# Altium schematic sheet Sheet1.SchDoc: Power Supply Active Load Testing Unit
size A4; SheetNumber: 1; SheetTotal: 1; PageSetup: Record=PageOptions|CenterHorizontal=True|CenterVertical=True|PrintScale=1.00|XCorrection=1.00|YCorrection=1.00|PrintKind=0|BorderSize=5000000|LeftOffset=0|BottomOffset=0|Orientation=2|PaperLength=1000|PaperWidth=1000|Scale=100|PaperSource=7|PrintQuality=-3|MediaType=1|DitherType=10|PrintScaleMode=1|PaperKind=A4|PaperIndex=9
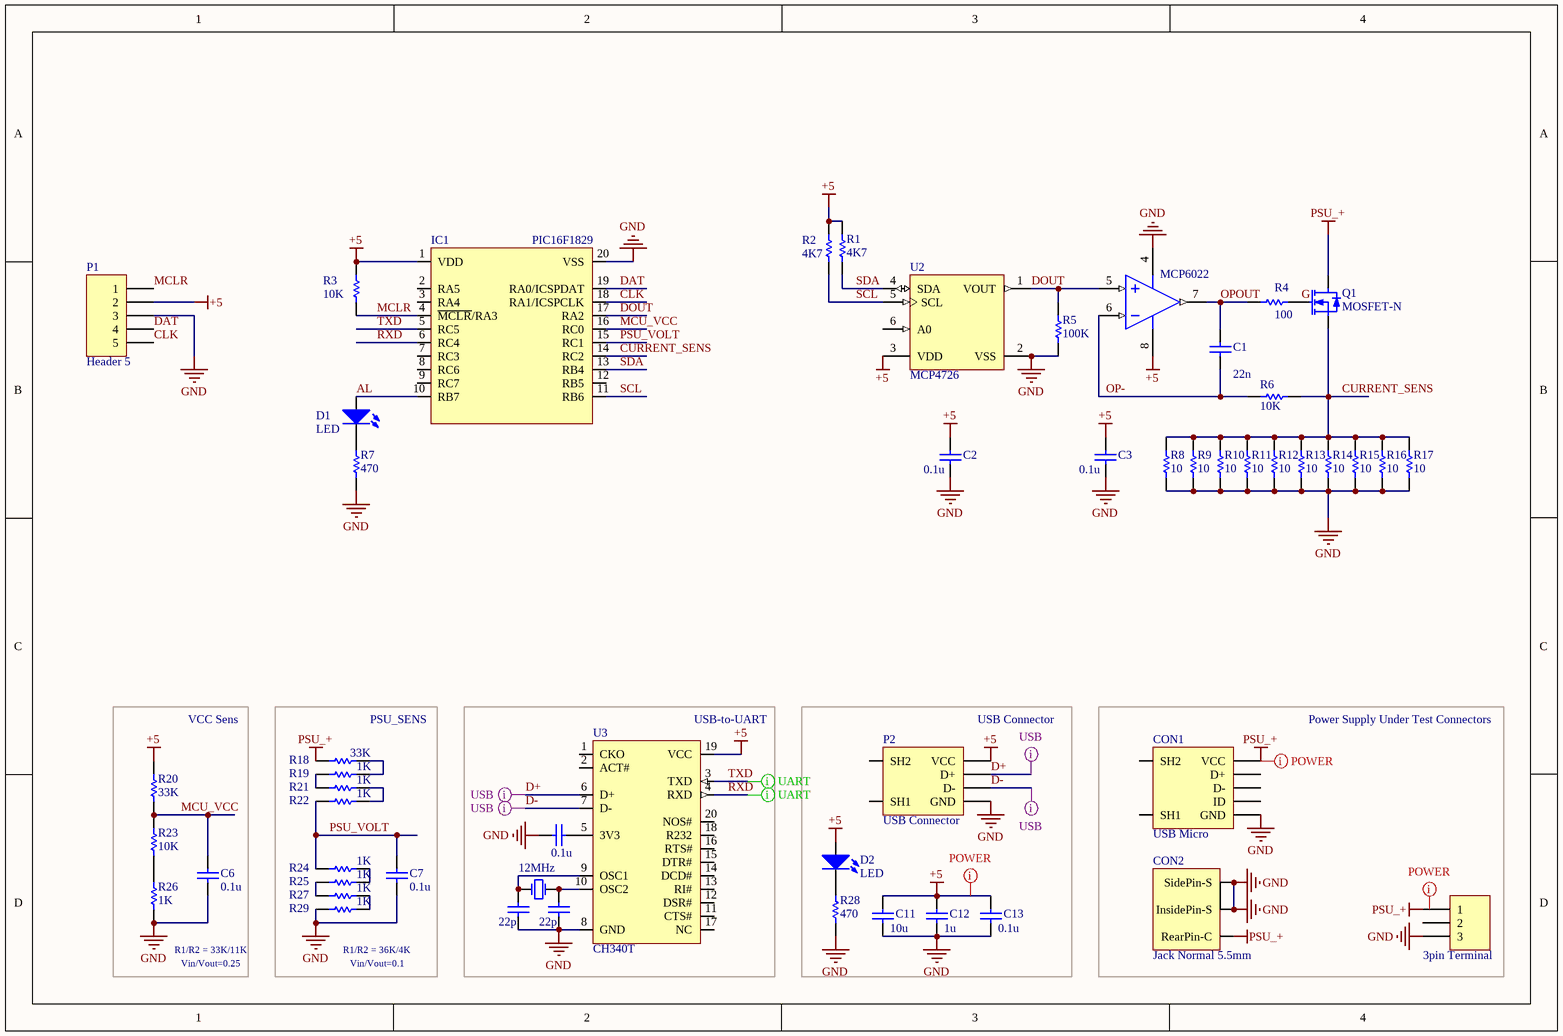
[diagram p0: Sheet1.SchDoc]

## Parts
C1  value 22n  [0805]  (hidden comment: Cap)
C2  value 0.1u  [0805]  (hidden comment: Cap)
C3  value 0.1u  [0805]  (hidden comment: Cap)
C5  value 0.1u  [0805]  (hidden comment: Cap)
C6  value 0.1u  [0805]  (hidden comment: Cap)
C7  value 0.1u  [0805]  (hidden comment: Cap)
C8  value 22p  [0805]  (hidden comment: Cap)
C9  value 22p  [0805]  (hidden comment: Cap)
C11  value 10u  [0805]  (hidden comment: Cap)
C12  value 1u  [0805]  (hidden comment: Cap)
C13  value 0.1u  [0805]  (hidden comment: Cap)
CON1  USB Micro  [USB Micro SMD]
CON2  Jack Normal 5.5mm  [Jack Normal]
CON3  3pin Terminal  [Terminal 3]
D1  LED  [LED 5mm [2.54 pin]]
D2  LED  [0805 -  LED]
IC1  PIC16F1829  [SOP20]
P1  Header 5  [Header 5x1]
P2  USB Connector  [USB Mini SMD TOP]
Q1  MOSFET-N  [TO-220 w HS2]
R1  value 4K7  [Axial 0.4]  (hidden comment: Res)
R2  value 4K7  [Axial 0.4]  (hidden comment: Res)
R3  value 10K  [0805]  (hidden comment: Res)
R4  value 100  [0805]  (hidden comment: Res)
R5  value 100K  [Axial 0.4]  (hidden comment: Res)
R6  value 10K  [0805]  (hidden comment: Res)
R7  value 470  [Axial 0.4]  (hidden comment: Res)
R8  value 10  [Axial 0.4]  (hidden comment: Res)
R9  value 10  [Axial 0.4]  (hidden comment: Res)
R10  value 10  [Axial 0.4]  (hidden comment: Res)
R11  value 10  [Axial 0.4]  (hidden comment: Res)
R12  value 10  [Axial 0.4]  (hidden comment: Res)
R13  value 10  [Axial 0.4]  (hidden comment: Res)
R14  value 10  [Axial 0.4]  (hidden comment: Res)
R15  value 10  [Axial 0.4]  (hidden comment: Res)
R16  value 10  [Axial 0.4]  (hidden comment: Res)
R17  value 10  [Axial 0.4]  (hidden comment: Res)
R18  value 33K  [0805]  (hidden comment: Res)
R19  value 1K  [0805]  (hidden comment: Res)
R20  value 33K  [0805]  (hidden comment: Res)
R21  value 1K  [0805]  (hidden comment: Res)
R22  value 1K  [0805]  (hidden comment: Res)
R23  value 10K  [0805]  (hidden comment: Res)
R24  value 1K  [0805]  (hidden comment: Res)
R25  value 1K  [0805]  (hidden comment: Res)
R26  value 1K  [0805]  (hidden comment: Res)
R27  value 1K  [0805]  (hidden comment: Res)
R28  value 470  [0805]  (hidden comment: Res)
R29  value 1K  [0805]  (hidden comment: Res)
U1  MCP6022  [PDIP300-P8]  (part B of 2)
U2  MCP4726  [SOT-23-CH6_N]
U3  CH340T  [SOP20-5.30mm-0.65pitch]
Y1  12MHz  [HC-49S]

## Blocks framed on the sheet
VCC Sens: C6 R20 R23 R26
PSU_SENS: C7 R18 R19 R21 R22 R24 R25 R27 R29
USB-to-UART: C5 C8 C9 U3 Y1
USB Connector: C11-C13 D2 P2 R28
Power Supply Under Test Connectors: CON1-CON3

## Nets
+5: C2.2 C3.2 C11.2 C12.2 C13.2 D2.A IC1.1(VDD) P1.2 P2.VCC R1.2 R2.2 R3.2 R20.2 U1.8(VDD) U2.3(VDD) U3.19(VCC)
GND: C2.1 C3.1 C5.2 C6.1 C7.1 C8.1 C9.1 C11.1 C12.1 C13.1 CON1.GND CON2.InsidePin(InsidePin-S) CON2.SidePin(SidePin-S) CON3.3 IC1.20(VSS) P1.3 P2.GND R5.1 R7.1 R8.1 R9.1 R10.1 R11.1 R12.1 R13.1 R14.1 R15.1 R16.1 R17.1 R26.1 R28.1 R29.2 U1.4(VSS) U2.2(VSS) U3.8(GND)
PSU_+: CON1.VCC CON2.RearPin(RearPin-C) CON3.1 Q1.2(D) R18.2
AL: D1.A IC1.10(RB7)
CLK: IC1.18(RA1/ICSPCLK) P1.5
CURRENT_SENS: IC1.14(RC2) Q1.3(S) R6.2 R8.2 R9.2 R10.2 R11.2 R12.2 R13.2 R14.2 R15.2 R16.2 R17.2
D+: P2.D+ U3.6(D+)
D-: P2.D- U3.7(D-)
DAT: IC1.19(RA0/ICSPDAT) P1.4
DOUT: IC1.17(RA2) R5.2 U1.5(VINB+) U2.1(VOUT)
G: Q1.1(G) R4.2
MCLR: IC1.4(~{MCLR}/RA3) P1.1 R3.1
MCU_VCC: C6.2 IC1.16(RC0) R20.1 R23.2
OP-: C1.1 R6.1 U1.6(VINB-)
OPOUT: C1.2 R4.1 U1.7(VOUTB)
PSU_VOLT: C7.2 IC1.15(RC1) R22.2 R24.2
RXD: IC1.6(RC4) U3.4(RXD)
SCL: IC1.11(RB6) R2.1 U2.5(SCL)
SDA: IC1.13(RB4) R1.1 U2.4(SDA)
TXD: IC1.5(RC5) U3.3(TXD)
NetC5_1: C5.1 U3.5(3V3)
NetC8_2: C8.2 U3.9(OSC1) Y1.1(OSC1)
NetC9_2: C9.2 U3.10(OSC2) Y1.2(OSC2)
NetD1_K: D1.K R7.2
NetD2_K: D2.K R28.2
NetR18_1: R18.1 R19.1
NetR19_2: R19.2 R21.2
NetR21_1: R21.1 R22.1
NetR23_1: R23.1 R26.2
NetR24_1: R24.1 R25.1
NetR25_2: R25.2 R27.2
NetR27_1: R27.1 R29.1

Not connected (* = marked no-connect by the designer): CON1 D+ D- ID SH1 SH2; CON3 2; IC1 2(RA5) 3(RA4) 7(RC3) 8(RC6) 9(RC7) 12(RB5); P2 SH1 SH2; U2 6(A0); U3 1(CKO) 2(ACT#) 11(CTS#) 12(DSR#) 13(RI#) 14(DCD#) 15(DTR#) 16(RTS#) 17(NC) 18(R232) 20(NOS#)

## Layout directives
net class USB: D+, D-
net class UART: RXD, TXD
net class POWER: (no net found under the mark), +5, PSU_+

## Notes on the sheet
- R1/R2 = 33K/11K
- Vin/Vout=0.25
- R1/R2 = 36K/4K
- Vin/Vout=0.1

## Library data of the parts
C1-C3 C5-C9 C11-C13 = Cap: Capacitor; Published: 8-Jun-2000; LatestRevisionDate: 17-Jul-2002; LatestRevisionNote: Re-released for DXP Platform.; PackageReference: RAD-0.3; Publisher: Altium Limited; PackageDescription: Radial Cap, Thru-Hole; 2 Leads; 0.3 in Pin Spacing
CON1 = USB Micro TH: Header, 4-Pin; LatestRevisionDate: 17-Jul-2002; LatestRevisionNote: Re-released for DXP Platform.; Publisher: Altium Limited
CON2 = Jack Normal 5.5mm: DC Jack - Center and Side pin Shorted!
CON3 = Terminal 3: Header, 3-Pin; LatestRevisionDate: 17-Jul-2002; LatestRevisionNote: Re-released for DXP Platform.; Publisher: Altium Limited
D1 D2 = LED: Typical RED GaAs LED; Published: 8-Jun-2000; LatestRevisionDate: 08-Jul-2005; LatestRevisionNote: Mech Layer 1 removed.; PackageReference: LED-1; Publisher: Altium Limited; PackageDescription: LED; 2 Leads
P1 = Header 5: Header, 5-Pin; LatestRevisionDate: 17-Jul-2002; LatestRevisionNote: Re-released for DXP Platform.; Publisher: Altium Limited
P2 = USB Connector: Header, 4-Pin; LatestRevisionDate: 17-Jul-2002; LatestRevisionNote: Re-released for DXP Platform.; Publisher: Altium Limited
Q1 = MOSFET-N: N-Channel MOSFET; Published: 8-Jun-2000; LatestRevisionDate: 17-Jul-2002; LatestRevisionNote: Re-released for DXP Platform.; PackageVersion: 1995/1996; PackageReference: E3; Publisher: Altium Limited; PackageDescription: TO, Flat Index; 3 In-Line, Axial Leads; Body Dia. 4.6mm; Lead Dia. 0.5 mm (max)
R1-R29 = Res: Resistor; Published: 8-Jun-2000; LatestRevisionDate: 17-Jul-2002; LatestRevisionNote: Re-released for DXP Platform.; PackageReference: AXIAL-0.3; Publisher: Altium Limited; PackageDescription: Axial Device, Thru-Hole; 2 Leads; 0.3 in Pin Spacing
U1 = MCP6022-I/P: Rail-to-Rail Input/Output, 10 MHz Operational Amplifier, 8-Pin PDIP, Industrial Temperature; Published: 29-Jan-2009; DatasheetVersion: revC, Mar-2006; PackageVersion: revAW, Oct-2008; PackageReference: PDIP300-P8; Publisher: Altium Limited; PackageDescription: 8-Lead Plastic Dual In-Line (P) - 300 mil Body [PDIP]; Code_JEDEC: MS-001; ComponentLink1Description: Manufacturer Link; ComponentLink1URL: http://www.microchip.com; ComponentLink2Description: Datasheet; ComponentLink2URL: http://ww1.microchip.com/downloads/en/DeviceDoc/21685c.pdf; ComponentLink3Description: Packaging Specification; ComponentLink3URL: http://ww1.microchip.com/downloads/en/PackagingSpec/00049AW.pdf
U2 = MCP4725A2T-E/CH: 12-Bit Digital-to-Analog Converter with EEPROM Memory in SOT-23-6, 6-Pin SOT-23, Extended Temperature, Tape and Reel; Published: 29-Jan-2009; DatasheetVersion: revC, Nov-2007; PackageVersion: revAW, Oct-2008; PackageReference: SOT-23-CH6; Publisher: Altium Limited; Code_IPC: SOT26A-6; ComponentLink1Description: Manufacturer Link; ComponentLink1URL: http://www.microchip.com; ComponentLink2Description: Datasheet; ComponentLink2URL: http://ww1.microchip.com/downloads/en/DeviceDoc/22039c.pdf; ComponentLink3Description: Packaging Specification; ComponentLink3URL: http://ww1.microchip.com/downloads/en/PackagingSpec/00049AW.pdf
U3 = CH340T: CH340T USB-to-UART
Y1 = XTAL: Crystal Oscillator; Published: 8-Jun-2000; LatestRevisionDate: 17-Jul-2002; LatestRevisionNote: Re-released for DXP Platform.; PackageReference: R38; Publisher: Altium Limited; PackageDescription: Crystal, Thru-Hole; 2 Leads; Body 3.1 x 8.2 mm (Dia.xH)